# Altium schematic sheet LOOMS.SchDoc
size A4; Organization: Electronic Research & Design; Address1: 11 Granofier; Address2: Zwartkop; Address3: Centurion; Address4: South Africa; Revision: 0
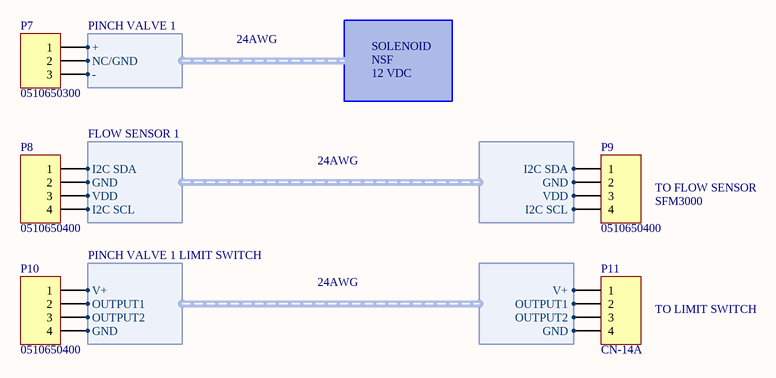
[diagram p0: LOOMS.SchDoc]

## Parts
P7  0510650300  [HDR1X3]
P8  0510650400  [HDR1X4]
P9  0510650400  [HDR1X4]
P10  0510650400  [HDR1X4]
P11  CN-14A  [HDR1X4]

## Harnesses
PINCH VALVE 1 LIMIT SWITCH: V+, OUTPUT1, OUTPUT2, GND
STEPPER LIMIT SWITCH: V+, OUTPUT1, OUTPUT2, GND
FLOW SENSOR 1: I2C SDA, GND, VDD, I2C SCL
STEPPER LIMIT SWITCH: I2C SDA, GND, VDD, I2C SCL
PINCH VALVE 1: +, NC/GND, -

## Nets
NetP7_1: P7.1 ; harness PINCH VALVE 1.+
NetP7_2: P7.2 ; harness PINCH VALVE 1.NC/GND
NetP7_3: P7.3 ; harness PINCH VALVE 1.-
NetP8_1: P8.1 P9.1 ; harness FLOW SENSOR 1.I2C SDA, harness STEPPER LIMIT SWITCH.I2C SDA
NetP8_2: P8.2 P9.2 ; harness FLOW SENSOR 1.GND, harness STEPPER LIMIT SWITCH.GND
NetP8_3: P8.3 P9.3 ; harness FLOW SENSOR 1.VDD, harness STEPPER LIMIT SWITCH.VDD
NetP8_4: P8.4 P9.4 ; harness FLOW SENSOR 1.I2C SCL, harness STEPPER LIMIT SWITCH.I2C SCL
NetP10_1: P10.1 P11.1 ; harness PINCH VALVE 1 LIMIT SWITCH.V+, harness STEPPER LIMIT SWITCH.V+
NetP10_2: P10.2 P11.2 ; harness PINCH VALVE 1 LIMIT SWITCH.OUTPUT1, harness STEPPER LIMIT SWITCH.OUTPUT1
NetP10_3: P10.3 P11.3 ; harness PINCH VALVE 1 LIMIT SWITCH.OUTPUT2, harness STEPPER LIMIT SWITCH.OUTPUT2
NetP10_4: P10.4 P11.4 ; harness PINCH VALVE 1 LIMIT SWITCH.GND, harness STEPPER LIMIT SWITCH.GND

## Notes on the sheet
- 24AWG
- SOLENOID
- NSF
- 12 VDC
- TO FLOW SENSOR
- SFM3000
- TO LIMIT SWITCH
- Title:
- Size:
- Date:
- Project:
- A4
- Number:
- Time:
- Revision:
- Sheet
- of
- File:

## Library data of the parts
P7 = Header 3: Receptacle, 3-circuit, 2mm pitch; Manufacturer: Molex; Mating Part: 532540370; Receptacle Socket: 0502128000; PartNumber: 0510650300
P8-P10 = Header 4: Receptacle, 4-circuit, 2mm pitch; Manufacturer: Molex; Mating Part: 532540470; Receptacle Socket: 0502128000; PartNumber: 0510650400
P11 = Header 4: Receptacle, 4-circuit, 2mm pitch; Manufacturer: Panasonic Industrial Automation; PartNumber: CN-14A